# Altium schematic sheet Revisions.SchDoc: Cartridge PCB
size A4; Engineer: Coen de Boer; Revision: V0.5 2118-G
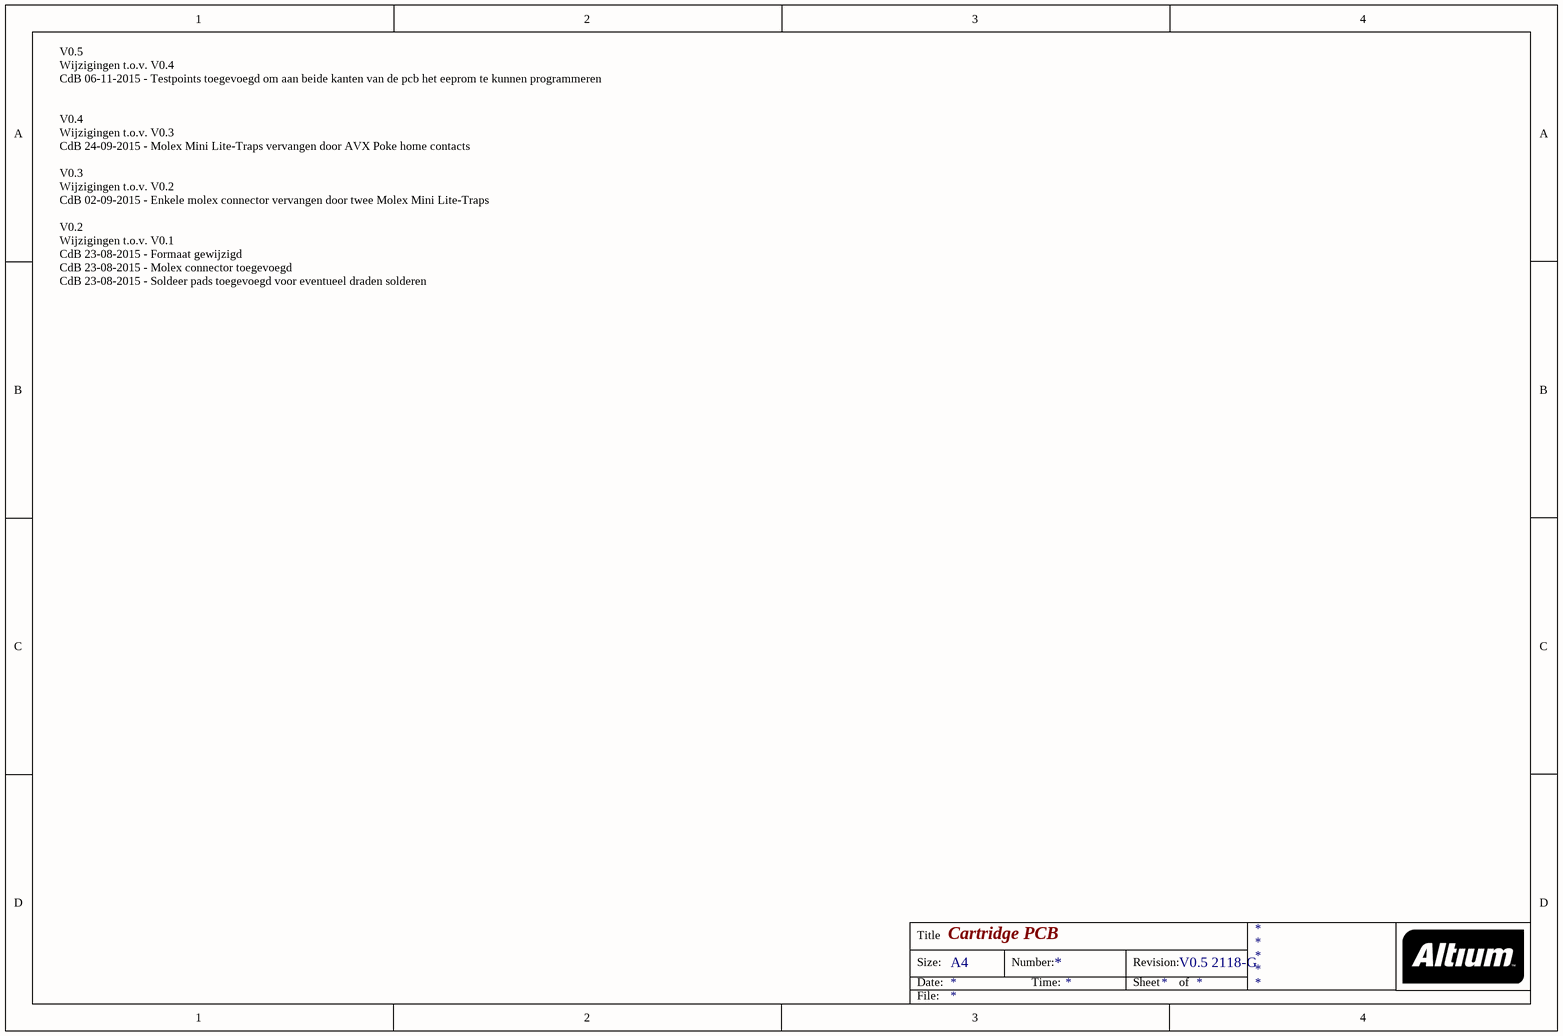
[diagram p0: Revisions.SchDoc]

## Notes on the sheet
- V0.5
  Wijzigingen t.o.v. V0.4
  CdB 06-11-2015 - Testpoints toegevoegd om aan beide kanten van de pcb het eeprom te kunnen programmeren
  V0.4
  Wijzigingen t.o.v. V0.3
  CdB 24-09-2015 - Molex Mini Lite-Traps vervangen door AVX Poke home contacts
  V0.3
  Wijzigingen t.o.v. V0.2
  CdB 02-09-2015 - Enkele molex connector vervangen door twee Molex Mini Lite-Traps
  V0.2
  Wijzigingen t.o.v. V0.1
  CdB 23-08-2015 - Formaat gewijzigd
  CdB 23-08-2015 - Molex connector toegevoegd
  CdB 23-08-2015 - Soldeer pads toegevoegd voor eventueel draden solderen
- Title
- Size:
- Date:
- A4
- Number:
- Time:
- Revision:
- Sheet
- of
- File: